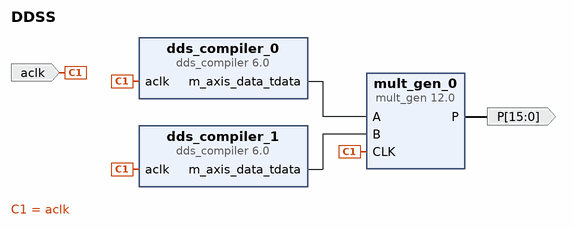
[diagram p0: block diagram of the top level]
# Vivado block design DDSS, xc7s15ftgb196-1, Vivado 2019.2
create_bd_design DDSS

create_bd_port -dir I aclk
create_bd_port -dir O -from 15 -to 0 -type data P

create_bd_cell -type ip -vlnv xilinx.com:ip:mult_gen:12.0 mult_gen_0
set_property -dict {CONFIG.PortAWidth 8 CONFIG.PortBWidth 8} [get_bd_cells mult_gen_0]
create_bd_cell -type ip -vlnv xilinx.com:ip:dds_compiler:6.0 dds_compiler_0
set_property -dict [list \
  CONFIG.Output_Frequency1 10 \
  CONFIG.Output_Selection Sine \
  CONFIG.PINC1 1100110011001100110011001 \
] [get_bd_cells dds_compiler_0]
create_bd_cell -type ip -vlnv xilinx.com:ip:dds_compiler:6.0 dds_compiler_1
set_property -dict [list \
  CONFIG.Output_Frequency1 5 \
  CONFIG.Output_Selection Sine \
  CONFIG.PINC1 110011001100110011001100 \
] [get_bd_cells dds_compiler_1]

# ---- connections ----

connect_bd_net [get_bd_ports aclk] [get_bd_pins dds_compiler_0/aclk] [get_bd_pins dds_compiler_1/aclk] [get_bd_pins mult_gen_0/CLK]
connect_bd_net [get_bd_pins dds_compiler_0/m_axis_data_tdata] [get_bd_pins mult_gen_0/A]
connect_bd_net [get_bd_pins dds_compiler_1/m_axis_data_tdata] [get_bd_pins mult_gen_0/B]
connect_bd_net [get_bd_pins mult_gen_0/P] [get_bd_ports P]

validate_bd_design
save_bd_design
